# Altium schematic sheet MezzDongle.SchDoc
size Letter
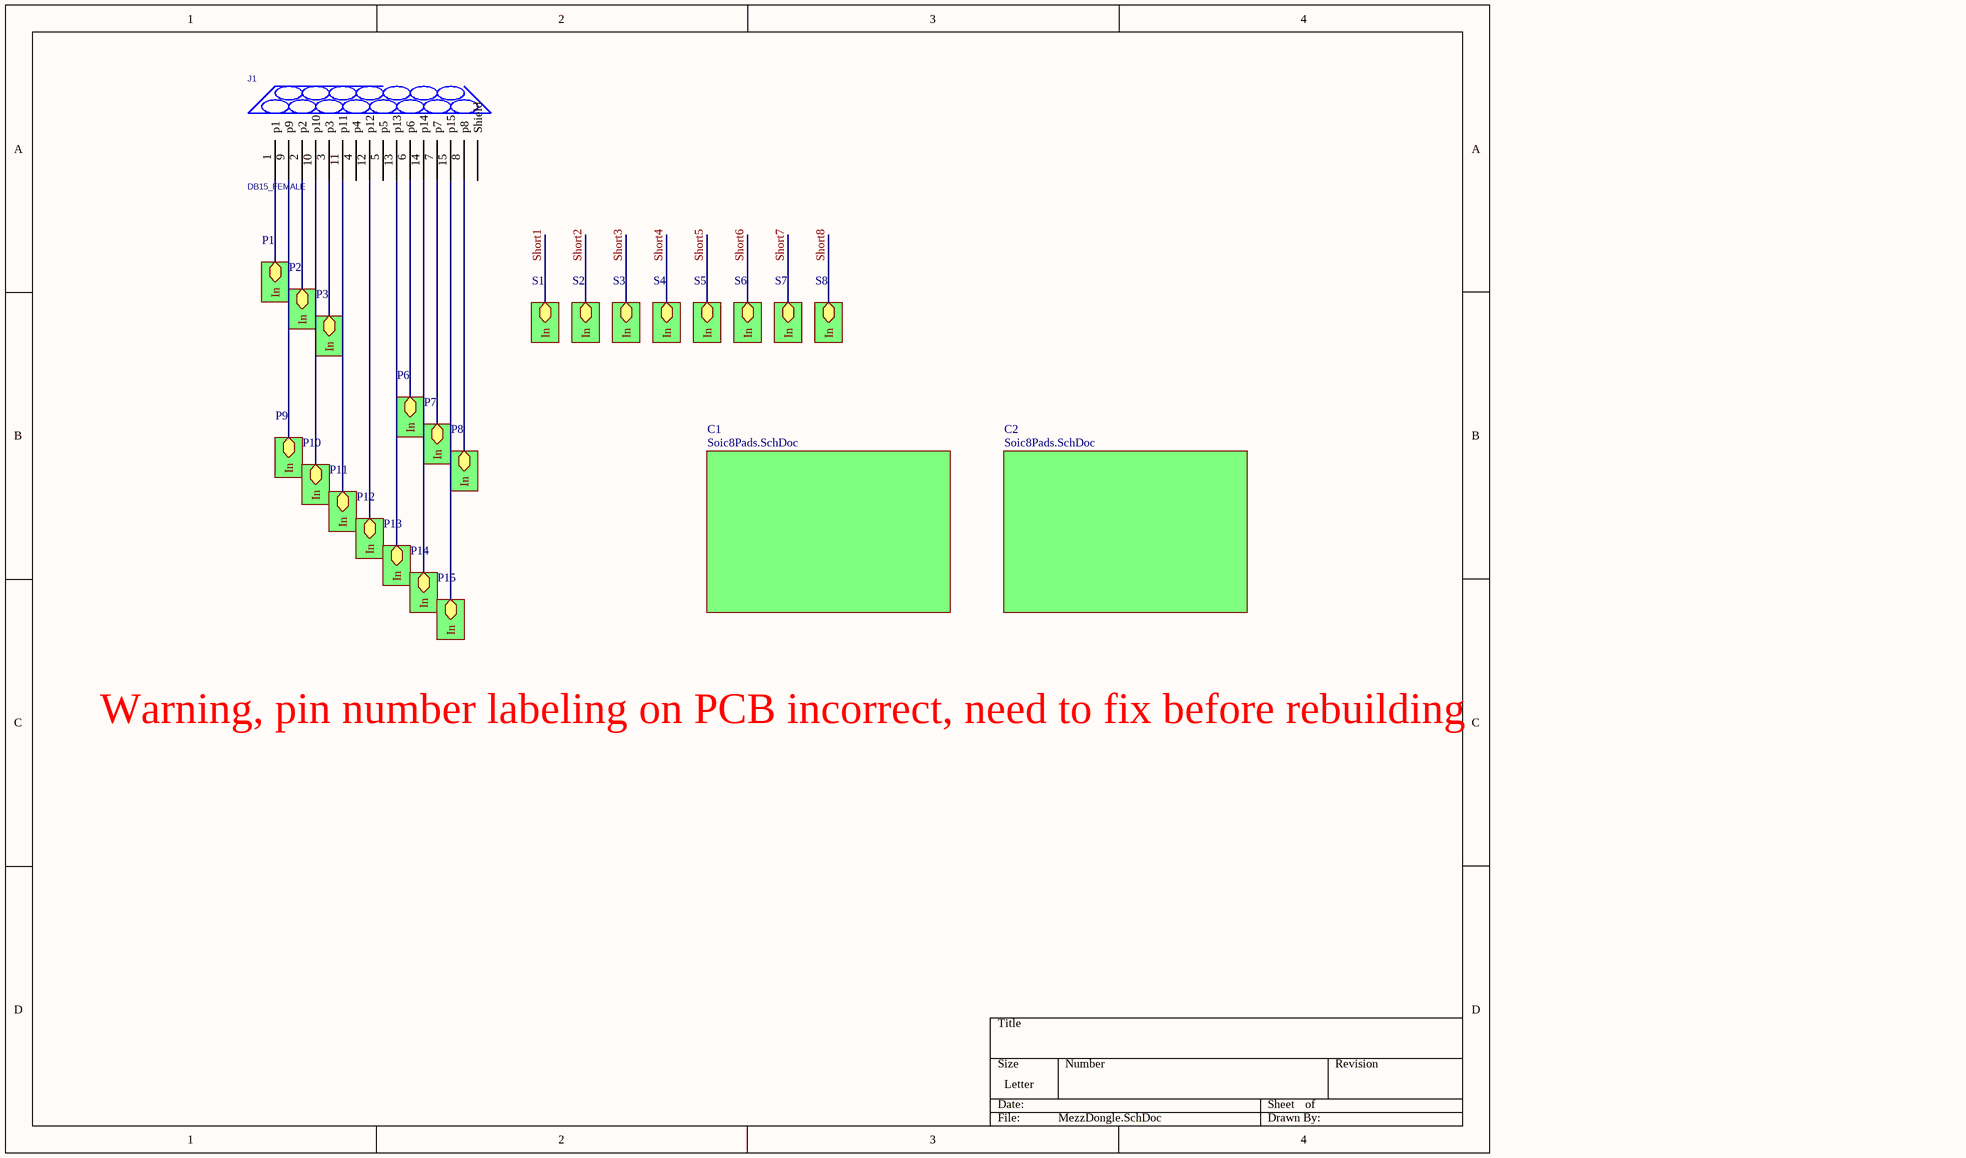
[diagram p0: MezzDongle.SchDoc]

## Parts
J1  DB15_FEMALE  [DSUB/RS.318/TM/15]

## Sub-sheets
C1 = Soic8Pads.SchDoc: no entries
C2 = Soic8Pads.SchDoc: no entries
P1 = ParallelVias.SchDoc: In
P2 = ParallelVias.SchDoc: In
P3 = ParallelVias.SchDoc: In
P6 = ParallelVias.SchDoc: In
P7 = ParallelVias.SchDoc: In
P8 = ParallelVias.SchDoc: In
P9 = ParallelVias.SchDoc: In
P10 = ParallelVias.SchDoc: In
P11 = ParallelVias.SchDoc: In
P12 = ParallelVias.SchDoc: In
P13 = ParallelVias.SchDoc: In
P14 = ParallelVias.SchDoc: In
P15 = ParallelVias.SchDoc: In
S1 = ParallelVias.SchDoc: In
S2 = ParallelVias.SchDoc: In
S3 = ParallelVias.SchDoc: In
S4 = ParallelVias.SchDoc: In
S5 = ParallelVias.SchDoc: In
S6 = ParallelVias.SchDoc: In
S7 = ParallelVias.SchDoc: In
S8 = ParallelVias.SchDoc: In

## Nets
Short1: sheet S1/In
Short2: sheet S2/In
Short3: sheet S3/In
Short4: sheet S4/In
Short5: sheet S5/In
Short6: sheet S6/In
Short7: sheet S7/In
Short8: sheet S8/In
NetJ1_1: J1.1(p1) ; sheet P1/In
NetJ1_2: J1.2(p2) ; sheet P2/In
NetJ1_3: J1.3(p3) ; sheet P3/In
NetJ1_6: J1.6(p6) ; sheet P6/In
NetJ1_7: J1.7(p7) ; sheet P7/In
NetJ1_8: J1.8(p8) ; sheet P8/In
NetJ1_9: J1.9(p9) ; sheet P9/In
NetJ1_10: J1.10(p10) ; sheet P10/In
NetJ1_11: J1.11(p11) ; sheet P11/In
NetJ1_12: J1.12(p12) ; sheet P12/In
NetJ1_13: J1.13(p13) ; sheet P13/In
NetJ1_14: J1.14(p14) ; sheet P14/In
NetJ1_15: J1.15(p15) ; sheet P15/In

Not connected (* = marked no-connect by the designer): J1 4(p4) 5(p5) Hole30(Shield)

## Notes on the sheet
- Warning, pin number labeling on PCB incorrect, need to fix before rebuilding

## Library data of the parts
J1 = DB15_FEMALE: COMPFIXED: NO; COMPGROUP: 0; COMPHEIGHT: 0.000; COMPLOC: [4502.733,1338.467]; COMPROT: 270; COMPSIDE: TOP; COMPKEY: NO; COMPLOCKED: NO; DECOUPLER: NO; MEMORY: NO